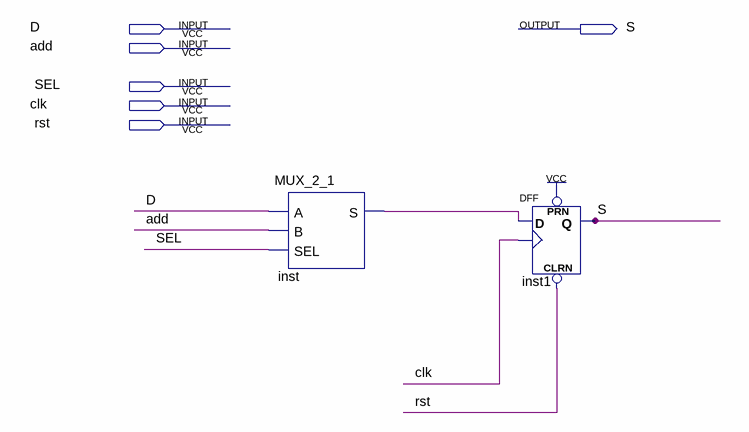
[diagram p0: schematic sheet]
// Quartus schematic bloco_contador.bdf as structural Verilog: 2 symbols, 6 pins
module bloco_contador (
  input  D,
  input  add,
  input  SEL,
  input  clk,
  input  rst,
  output S
);

  wire inst_s;

  MUX_2_1 inst (.A(D), .B(add), .SEL(SEL), .S(inst_s));
  DFF inst1 (.CLRN(rst), .CLK(clk), .D(inst_s), .PRN(1'b1), .Q(S));
endmodule
